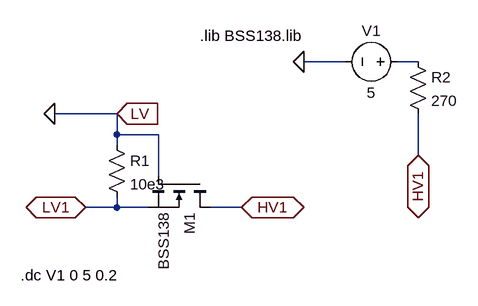
[diagram p0: schematic Draft2.asc]
Draft2.asc, the LTspice schematic file:
Version 4
SHEET 1 880 680
WIRE 464 0 400 0
WIRE 576 0 544 0
WIRE 112 80 16 80
WIRE 112 112 112 80
WIRE 176 112 112 112
WIRE 112 128 112 112
WIRE 576 144 576 80
WIRE 176 176 176 112
WIRE 112 224 112 208
WIRE 112 224 64 224
WIRE 160 224 112 224
WIRE 304 224 256 224
FLAG 64 224 LV1
IOPIN 64 224 BiDir
FLAG 304 224 HV1
IOPIN 304 224 BiDir
FLAG 112 80 LV
IOPIN 112 80 In
FLAG 16 80 0
FLAG 400 0 0
FLAG 576 144 HV1
IOPIN 576 144 BiDir
SYMBOL res 96 112 R0
SYMATTR InstName R1
SYMATTR Value 10e3
SYMBOL nmos 256 176 R90
SYMATTR InstName M1
SYMATTR Value BSS138
SYMBOL res 560 -16 R0
SYMATTR InstName R2
SYMATTR Value 270
SYMBOL voltage 560 0 R90
WINDOW 0 -32 56 VBottom 2
WINDOW 3 32 56 VTop 2
WINDOW 123 0 0 Left 0
WINDOW 39 0 0 Left 0
SYMATTR InstName V1
SYMATTR Value 5
TEXT 240 -40 Left 2 !.lib BSS138.lib
TEXT -36 328 Left 2 !.dc V1 0 5 0.2

The netlist it stands for:
* Draft2.asc
R1 0 LV1 10e3
M1 HV1 0 LV1 LV1 BSS138
R2 N001 HV1 270
V1 N001 0 5
.model NMOS NMOS
.model PMOS PMOS
.lib standard.mos
.lib BSS138.lib
.dc V1 0 5 0.2
.backanno
.end